# Altium schematic sheet PAM8403.SchDoc
size A; Author: Erick Miranda Quinde; DrawnBy: Erick Miranda Quinde; DocumentNumber: 0000-0000-0004; Revision: V2.0; SheetNumber: 4; SheetTotal: 5
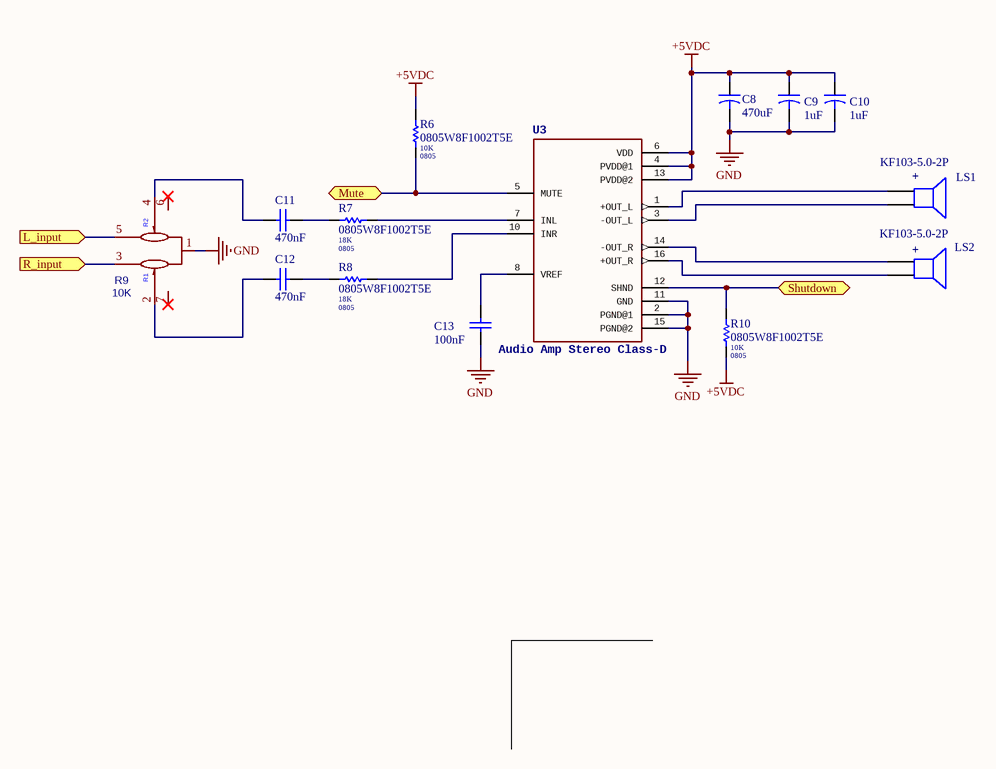
[diagram p0: PAM8403.SchDoc]

## Parts
C8  470uF  [7343–31]
C9  1uF  [C3216X5R1C106K]
C10  1uF  [C3216X5R1C106K]
C11  470nF  [C0603C104K5RACTU]
C12  470nF  [C0603C104K5RACTU]
C13  100nF  [C0603C104K5RACTU]
LS1  KF103-5.0-2P  [VERDE 2pin]
LS2  KF103-5.0-2P  [VERDE 2pin]
R6  0805W8F1002T5E  value 10K  Package: 0805  [RES-0805]
R7  0805W8F1002T5E  value 18K  Package: 0805  [RES-0805]
R8  0805W8F1002T5E  value 18K  Package: 0805  [RES-0805]
R9  10K  [RES-TH_RK10J12E002L]
R10  0805W8F1002T5E  value 10K  Package: 0805  [RES-0805]
U3  Audio Amp Stereo Class-D  [SOIC-16]

## Ports
L_input (in), Mute (bidir), R_input (in), Shutdown (bidir)

## Nets
+5VDC: C8.1 C9.1 C10.1 R6.1 R10.1 U3.4(PVDD@1) U3.6(VDD) U3.13(PVDD@2)
GND: C8.2 C9.2 C10.2 C13.1 R9.1 U3.2(PGND@1) U3.11(GND) U3.15(PGND@2)
L_input: R9.5 ; port L_input
Mute: R6.2 U3.5(MUTE) ; port Mute
R_input: R9.3 ; port R_input
Shutdown: R10.2 U3.12(SHND) ; port Shutdown
NetC11_1: C11.1 R7.1
NetC11_2: C11.2 R9.4
NetC12_1: C12.1 R8.1
NetC12_2: C12.2 R9.2
NetC13_2: C13.2 U3.8(VREF)
NetLS1_1: LS1.1 U3.1(+OUT_L)
NetLS1_2: LS1.2 U3.3(-OUT_L)
NetLS2_1: LS2.1 U3.16(+OUT_R)
NetLS2_2: LS2.2 U3.14(-OUT_R)
NetR7_2: R7.2 U3.7(INL)
NetR8_2: R8.2 U3.10(INR)

Not connected (* = marked no-connect by the designer): R9 6(EH)* 7(EH)*

## Notes on the sheet
- (near LS1) +
- (near LS2) +
- (in symbol 10K) R2; R1

## Library data of the parts
C8 = Cap 470uF-6.3V Tantalium: Capacitor; Value: 470uF
C9 C10 = Cap 10uF (C3216): Capacitor; Value: 1uF
C11-C13 = Cap 100nF (0603)
  C11 C12: Value: 470nF
  C13: Value: 100nF
LS1 LS2 = Speaker: Published: 24-Mar-1999; LatestRevisionDate: 17-Jul-2002; LatestRevisionNote: Re-released for DXP Platform.; PackageReference: PIN2; Publisher: Altium Limited; Price: $0.12; Link Store: https://lcsc.com/product-detail/New-Quadratic-Unclassified-Data_Cixi-Kefa-Elec-KF103-5-0-2P_C475088.html; LCSC Part: C475088
R6-R8 R10 = Resistor: Published: 8-Jun-2000; LatestRevisionDate: 17-Jul-2002; LatestRevisionNote: Re-released for DXP Platform.; PackageReference: AXIAL-0.3; Publisher: Altium Limited; PackageDescription: Axial Device, Thru-Hole; 2 Leads; 0.3 in Pin Spacing; Price: $0.0023; Link Store: https://lcsc.com/product-detail/Chip-Resistor-Surface-Mount_UNI-ROYAL-Uniroyal-Elec-0805W8F1002T5E_C17414.html; LCSC Part: C17414
R9 = 10K: BOM_Manufacturer: ALPS Electric; BOM_Manufacturer Part: RK10J12E002L; nameAlias: Resistance (Ohms); Contributor: LCSC; BOM_Supplier: LCSC; BOM_Supplier Part: C231765; spicePre: R; spiceSymbolName: RK10J12E002L
U3 = PAM8403DR: MF: Diodes Inc.; MP: PAM8403DR; Price: Average Price: / $0.44 USD; Availability: Good; Package: None